# EAGLE design USB_TTL_Adapter_V1.1 (EAGLE 7.7.0)
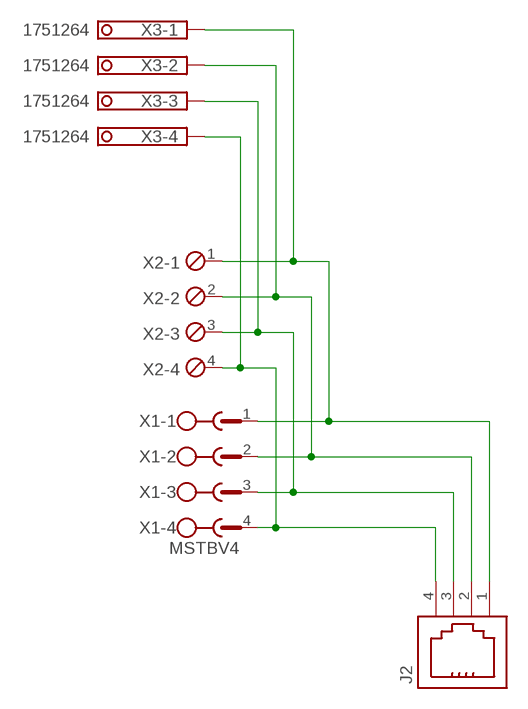
[diagram p0: schematic, sheet 1]

## Parts
J2  615004144021  [615004144021]
X1  MSTBV4  [MSTBV4]
X2  MPT4  [4POL254]
X3  1751264  [1751264]

## Nets
N$1: J2.4 X1.4 X2.4 X3.4
N$2: J2.3 X1.3 X2.3 X3.3
N$3: J2.2 X1.2 X2.2 X3.2
N$4: J2.1 X1.1 X2.1 X3.1

## Library data of the parts
J2 = InputOutputIO (rev18b):615004144021: WR-MJ Vertical Plastic 4P4C Modular Jack With Ears, 4 pins=>Code : Con_I-O_MJ-V_Plastic_615004144021 <http://katalog.we-online.de/media/images/eican/Con_I-O_MJ-V_Plastic_615004144021_pf2.jpg> Details see: http://katalog.we-online.de/en/em/MJ_VERTICAL_PLASTIC_4P4C_W_EARS Created 2014-07-10, Karrer Zheng 2014 (C) Würth Elektronik
X1 = con-phoenix-508:MSTBV4: PHOENIX; MPN: MSTBV 2,5/4-GF-5.08; OC_FARNELL: 1792794; OC_NEWARK: 69R9847
X2 = con-phoenix-254:MPT4: PHOENIX CONNECTOR; OC_FARNELL: unknown; OC_NEWARK: unknown
X3 = con-phoenix-350:1751264: MKDS 1/ 4-3,5 Printklemme Nennstrom: 10 A Bemessungsspannung: 160 V Raster: 3,5 mm Polzahl: 4 Montageart: Löten Anschlussart: Schraubanschluss Anschlussrichtung vom Leiter zur Platine: 0° Source: http://eshop.phoenixcontact.com .. 1751264.pdf; MPN: 1751264; OC_FARNELL: unknown; OC_NEWARK: 10R0934

## Board
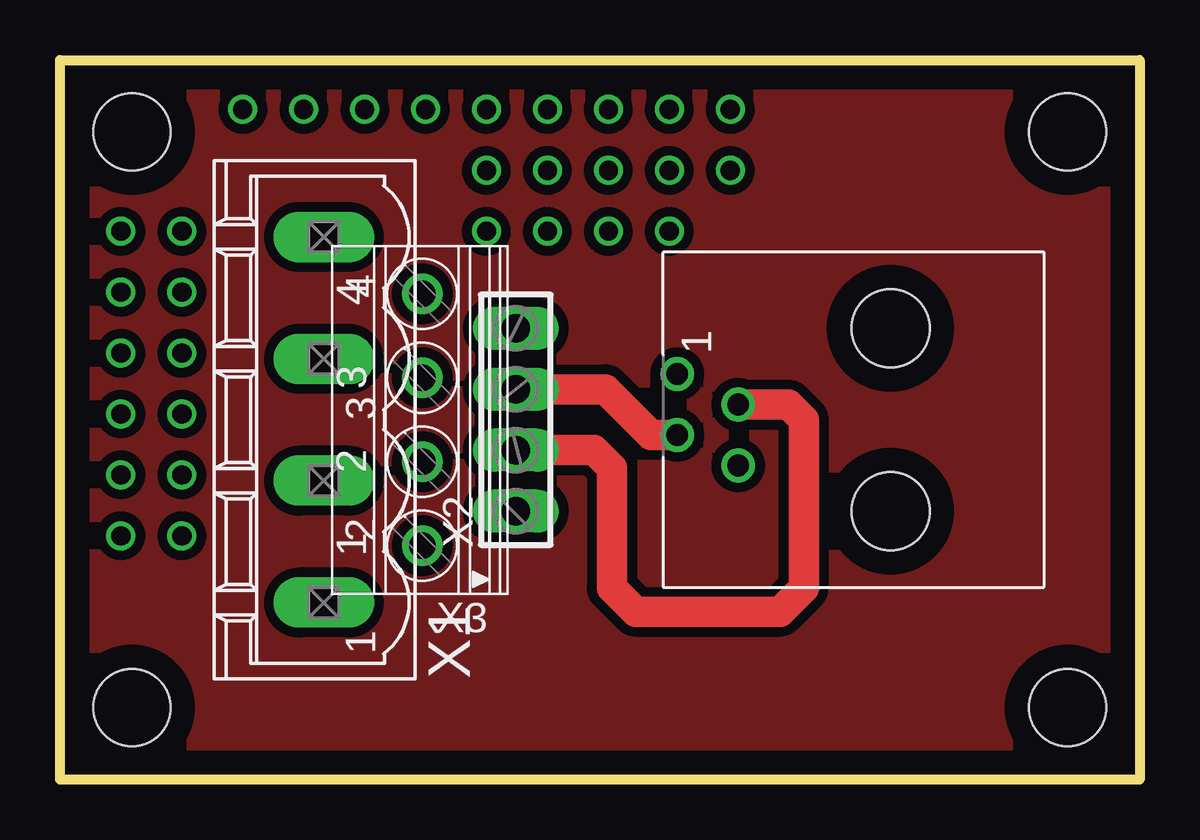
[diagram p1: board, top side]
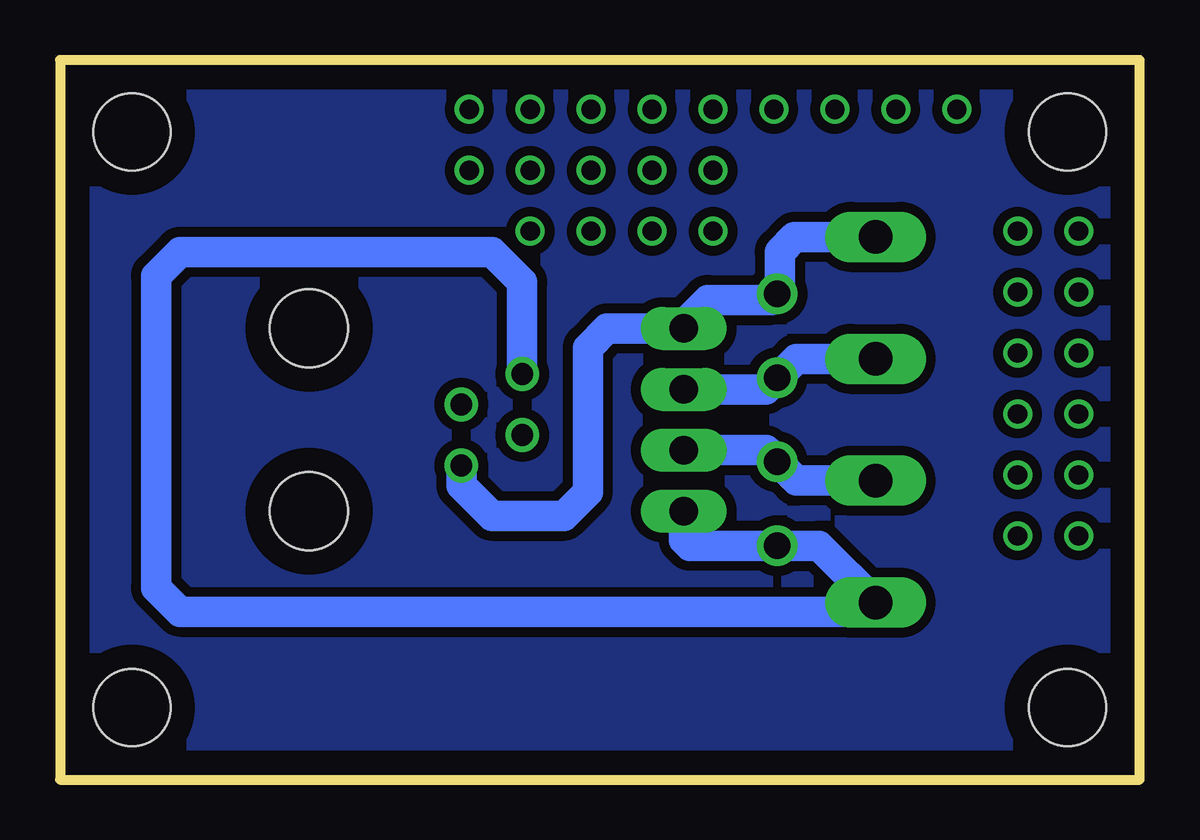
[diagram p2: board, bottom side, seen from below]

Size 45 x 30 mm. Coordinates in mm from the lower left corner, seen from the top.
Outline: 0,0 0,30 45,30 45,0 0,0
Copper layers (1*16): Top 0.035mm / dielectric 1.5mm / Bottom 0.035mm
Design rules "default": minimum track width 10mil, minimum drill 24mil, track to track 8mil, track to pad 8mil, pad to pad 8mil, via to via 8mil, smd to smd 8mil, copper to edge 40mil, drill to drill 8mil, minimum pad ring 10mil, minimum via ring 8mil, stop-mask expansion 4mil, vias tented up to drill 0mil, thermal gap 10mil
Holes 3.2 mm at 42,3 3,27 42,27 3,3

### Footprints (pad centres in the part's own frame; a part is rotated, then mirrored left to right if it is on the bottom)
615004144021 = drill 0.9: 1 -1.905,-1.27; 2 -0.635,1.27; 3 0.635,-1.27; 4 1.905,1.27 | hole 3.25: -3.81,7.62; 3.81,7.62
MSTBV4 = drill 1.397 long: 1 -7.62,0; 2 -2.54,0; 3 2.54,0; 4 7.62,0
4POL254 = drill 1.2 long: 1 -3.81,0; 2 -1.27,0; 3 1.27,0; 4 3.81,0
1751264 = drill 1.1 pad 1.7: 1 -5.25,-0.1; 2 -1.75,-0.1; 3 1.75,-0.1; 4 5.25,-0.1

### Placement (x,y rotation side)
J2  27,15 270 top
U$1  [25X25_BEST]  21.4,4.4 10 top
X1  11,15 90 top
X2  19,15 90 top
X3  15,15 90 top

### Tracks (layer width: path | path; a pad name or v marks a point on that pad's centre or on a via)
GND
  pour Bottom (isolate 0.406): 17,0 0,0 0,30 45,30 45,0
  pour Top (isolate 0.406): 17,0 0,0 0,30 45,30 45,0
N$1
  Bottom 1.27: X1.4 14.38,22.62 15,22 15,20.35 X3.4 15.35,20 18,20 19,19 X2.4 22.19,18.81 23,18 23,12 24,11 27,11 28.27,12.27 J2.4
N$2
  Top 1.27: J2.3 24.64,14.37 22.73,16.27 X2.3
  Bottom 1.27: X1.3 14.31,17.54 X3.3 15.58,16.27 X2.3
N$3
  Top 1.27: X2.2 22.27,13.73 23,13 23,8 24,7 30,7 31,8 31,15 30.36,15.63 J2.2
  Bottom 1.27: X1.2 14.31,12.46 X3.2 15.58,13.73 X2.2
N$4
  Bottom 1.27: X2.1 19,10 18.75,9.75 X3.1 13.37,9.75 X1.1 11.38,7 40,7 41,8 41,21 40,22 27,22 25.73,20.73 J2.1
N$5  (via drill 0.8)
  other vias: 17.78,27.94
N$6  (via drill 0.8)
  other vias: 20.32,27.94
N$7  (via drill 0.8)
  other vias: 17.78,25.4
N$8  (via drill 0.8)
  other vias: 20.32,25.4
N$9  (via drill 0.8)
  other vias: 17.78,22.86
N$10  (via drill 0.8)
  other vias: 20.32,22.86
N$11  (via drill 0.8)
  other vias: 22.86,22.86
N$12  (via drill 0.8)
  other vias: 22.86,25.4
N$13  (via drill 0.8)
  other vias: 22.86,27.94
N$14  (via drill 0.8)
  other vias: 25.4,27.94
N$15  (via drill 0.8)
  other vias: 25.4,25.4
N$17  (via drill 0.8)
  other vias: 25.4,22.86
N$18  (via drill 0.8)
  other vias: 27.94,27.94
N$19  (via drill 0.8)
  other vias: 27.94,25.4
N$20  (via drill 0.8)
  other vias: 5.08,10.16
N$28  (via drill 0.8)
  other vias: 15.24,27.94
N$29  (via drill 0.8)
  other vias: 12.7,27.94
N$30  (via drill 0.8)
  other vias: 10.16,27.94
N$31  (via drill 0.8)
  other vias: 7.62,27.94
N$32  (via drill 0.8)
  other vias: 2.54,22.86
N$33  (via drill 0.8)
  other vias: 5.08,22.86
N$34  (via drill 0.8)
  other vias: 5.08,20.32
N$35  (via drill 0.8)
  other vias: 2.54,20.32
N$36  (via drill 0.8)
  other vias: 2.54,17.78
N$37  (via drill 0.8)
  other vias: 5.08,17.78
N$38  (via drill 0.8)
  other vias: 5.08,15.24
N$39  (via drill 0.8)
  other vias: 2.54,15.24
N$40  (via drill 0.8)
  other vias: 2.54,12.7
N$41  (via drill 0.8)
  other vias: 5.08,12.7
N$42  (via drill 0.8)
  other vias: 2.54,10.16

### Text on the board
Bestückungsdruck: 1: VCC | 2: GND | 3: RxD | 4: TxD